# Altium schematic sheet SAML21_Xplained_Pro_Target_MCU.SchDoc: Target MCU
size A3; Organization: ATMEL Norway; Address1: Vestre Rosten 79; Address2: N-7075 TILLER; Address3: NORWAY; DocumentNumber: A09-2241; Revision: 4; SheetNumber: 2; SheetTotal: 10; PageSetup: Record=PageOptions|CenterHorizontal=True|CenterVertical=True|PrintScale=1.01|XCorrection=1.00|YCorrection=1.00|PrintKind=1|BorderSize=5000000|LeftOffset=0|BottomOffset=0|Orientation=2|PaperLength=1000|PaperWidth=1000|Scale=100|PaperSource=7|PrintQuality=-4|MediaType=1|DitherType=10|PaperKind=A3 (297 x 420 mm)|PrintScaleMode=1
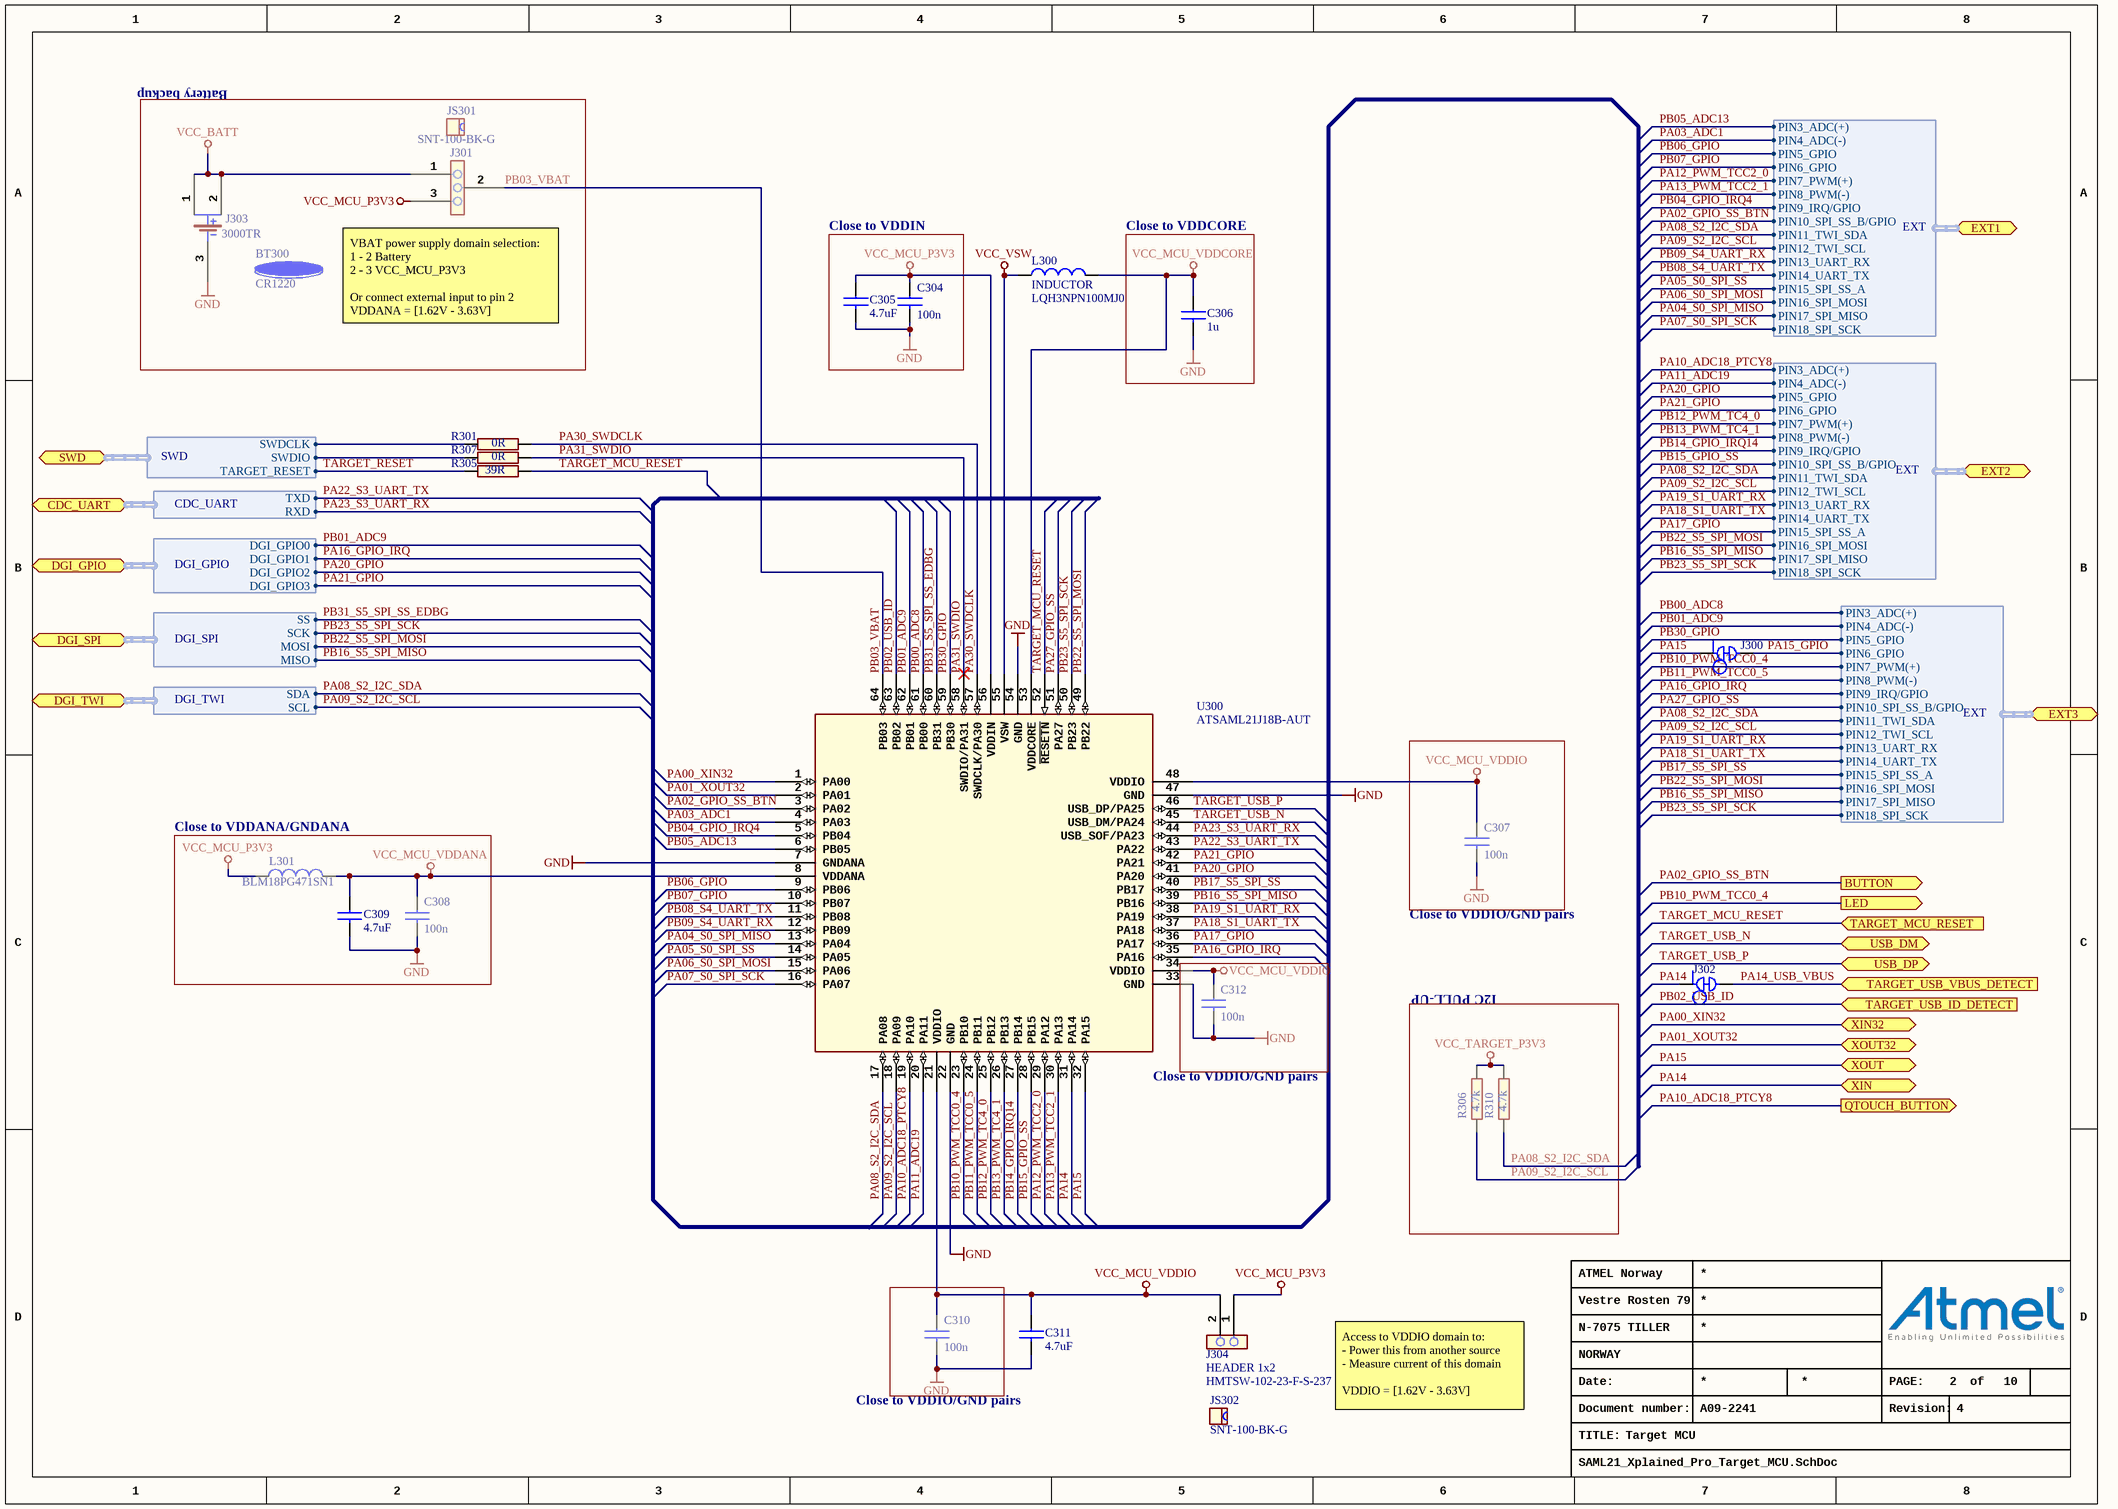
[diagram p0: SAML21_Xplained_Pro_Target_MCU.SchDoc]

## Parts
BT300  value CR1220  [AP9-00125]  (hidden comment: COIN-CELL)
C304  value 100n  [AP1-00053]  (hidden comment: CAP-NONPOL)
C305  value 4.7uF  [AP1-00117]  (hidden comment: CAP-NONPOL)
C306  value 1u  [AP1-00053]  (hidden comment: CAP-NONPOL)
C307  value 100n  [AP1-00053]  (hidden comment: CAP-NONPOL)
C308  value 100n  [AP1-00053]  (hidden comment: CAP-NONPOL)
C309  value 4.7uF  [AP1-00117]  (hidden comment: CAP-NONPOL)
C310  value 100n  [AP1-00053]  (hidden comment: CAP-NONPOL)
C311  value 4.7uF  [AP1-00117]  (hidden comment: CAP-NONPOL)
C312  value 100n  [AP1-00053]  (hidden comment: CAP-NONPOL)
J300  (no value)  [AP9-00044]  (net tie, no BOM)
J301  Same as A08-1614 but with 1mm hole for optimal reflow soldering (no misalignment of the component)  [AP8-00745]  (value not drawn)
J302  (no value)  [AP9-00044]  (net tie, no BOM)
J303  value 3000TR  [AP8-00313]  (hidden comment: Elfa no: 69-525-01)
J304  HEADER 1x2  value HMTSW-102-23-F-S-237  [AP8-00733]
JS301  value SNT-100-BK-G  [AP8-00525]
JS302  value SNT-100-BK-G  [AP8-00525]
L300  INDUCTOR  value LQH3NPN100MJ0  [AP3-00115]
L301  BLM18PG471SN1  [AP3-00005]
R301  value 0R  [AP2-00011]  (hidden comment: R2)
R305  value 39R  [AP2-00011]  (hidden comment: R2)
R306  value 4.7k  [AP2-00011]  (hidden comment: R2)
R307  value 0R  [AP2-00011]  (hidden comment: R2)
R310  value 4.7k  [AP2-00011]  (hidden comment: R2)
U300  value ATSAML21J18B-AUT  [AP6-00173]  (hidden comment: TQFP64)

## Blocks framed on the sheet
Battery backup: BT300 J301 J303 JS301
Close to VDDIN: C304 C305
Close to VDDCORE: C306
Close to VDDANA/GNDANA: C308 C309 L301
I2C PULL-UP: R306 R310

## Ports
BUTTON (out), CDC_UART (harness CDC_UART), DGI_GPIO (harness DGI_GPIO), DGI_SPI (harness DGI_SPI), DGI_TWI (harness DGI_TWI), EXT1 (harness EXT), EXT2 (harness EXT), EXT3 (harness EXT), LED (out), QTOUCH_BUTTON (out), SWD (harness SWD), TARGET_MCU_RESET (in), TARGET_USB_ID_DETECT (in), TARGET_USB_VBUS_DETECT (in), USB_DM (bidir), USB_DP (bidir), XIN32 (bidir), XIN (bidir), XOUT32 (bidir), XOUT (bidir)

## Harnesses
SWD: SWDCLK, SWDIO, TARGET_RESET
DGI_GPIO: DGI_GPIO0, DGI_GPIO1, DGI_GPIO2, DGI_GPIO3
DGI_SPI: MISO, MOSI, SCK, SS
DGI_TWI: SCL, SDA
CDC_UART: RXD, TXD
EXT: PIN10_SPI_SS_B/GPIO, PIN11_TWI_SDA, PIN12_TWI_SCL, PIN13_UART_RX, PIN14_UART_TX, PIN15_SPI_SS_A, PIN16_SPI_MOSI, PIN17_SPI_MISO, PIN18_SPI_SCK, PIN3_ADC(+), PIN4_ADC(-), PIN5_GPIO, PIN6_GPIO, PIN7_PWM(+), PIN8_PWM(-), PIN9_IRQ/GPIO

## Nets
GND: C304.2 C305.2 C306.2 C307.2 C308.2 C309.2 C310.2 C311.2 C312.2 J303.3 U300.7(GNDANA) U300.22(GND) U300.33(GND) U300.47(GND) U300.54(GND)
VCC_BATT: J301.1 J303.1 J303.2
VCC_MCU_P3V3: C304.1 C305.1 J301.3 J304.1 L301.1 U300.56(VDDIN)
VCC_MCU_VDDANA: C308.1 C309.1 L301.2 U300.8(VDDANA)
VCC_MCU_VDDCORE: C306.1 L300.2 U300.53(VDDCORE)
VCC_MCU_VDDIO: C307.1 C310.1 C311.1 C312.1 J304.2 U300.21(VDDIO) U300.34(VDDIO) U300.48(VDDIO)
VCC_TARGET_P3V3: R306.2 R310.2
VCC_VSW: L300.1 U300.55(VSW)
PA00_XIN32: U300.1(PA00) ; port XIN32
PA01_XOUT32: U300.2(PA01) ; port XOUT32
PA02_GPIO_SS_BTN: U300.3(PA02) ; port BUTTON, port EXT1.PIN10_SPI_SS_B/GPIO
PA03_ADC1: U300.4(PA03) ; port EXT1.PIN4_ADC(-)
PA04_S0_SPI_MISO: U300.13(PA04) ; port EXT1.PIN17_SPI_MISO
PA05_S0_SPI_SS: U300.14(PA05) ; port EXT1.PIN15_SPI_SS_A
PA06_S0_SPI_MOSI: U300.15(PA06) ; port EXT1.PIN16_SPI_MOSI
PA07_S0_SPI_SCK: U300.16(PA07) ; port EXT1.PIN18_SPI_SCK
PA08_S2_I2C_SDA: R310.1 U300.17(PA08) ; port DGI_TWI.SDA, port EXT1.PIN11_TWI_SDA, port EXT2.PIN11_TWI_SDA, port EXT3.PIN11_TWI_SDA
PA09_S2_I2C_SCL: R306.1 U300.18(PA09) ; port DGI_TWI.SCL, port EXT1.PIN12_TWI_SCL, port EXT2.PIN12_TWI_SCL, port EXT3.PIN12_TWI_SCL
PA10_ADC18_PTCY8: U300.19(PA10) ; port QTOUCH_BUTTON, port EXT2.PIN3_ADC(+)
PA11_ADC19: U300.20(PA11) ; port EXT2.PIN4_ADC(-)
PA12_PWM_TCC2_0: U300.29(PA12) ; port EXT1.PIN7_PWM(+)
PA13_PWM_TCC2_1: U300.30(PA13) ; port EXT1.PIN8_PWM(-)
PA14: J302.1 U300.31(PA14) ; port XIN
PA14_USB_VBUS: J302.2 ; port TARGET_USB_VBUS_DETECT
PA15: J300.1 U300.32(PA15) ; port XOUT
PA15_GPIO: J300.2 ; port EXT3.PIN6_GPIO
PA16_GPIO_IRQ: U300.35(PA16) ; port DGI_GPIO.DGI_GPIO1, port EXT3.PIN9_IRQ/GPIO
PA17_GPIO: U300.36(PA17) ; port EXT2.PIN15_SPI_SS_A
PA18_S1_UART_TX: U300.37(PA18) ; port EXT2.PIN14_UART_TX, port EXT3.PIN14_UART_TX
PA19_S1_UART_RX: U300.38(PA19) ; port EXT2.PIN13_UART_RX, port EXT3.PIN13_UART_RX
PA20_GPIO: U300.41(PA20) ; port DGI_GPIO.DGI_GPIO2, port EXT2.PIN5_GPIO
PA21_GPIO: U300.42(PA21) ; port DGI_GPIO.DGI_GPIO3, port EXT2.PIN6_GPIO
PA22_S3_UART_TX: U300.43(PA22) ; port CDC_UART.TXD
PA23_S3_UART_RX: U300.44(USB_SOF/PA23) ; port CDC_UART.RXD
PA27_GPIO_SS: U300.51(PA27) ; port EXT3.PIN10_SPI_SS_B/GPIO
PA30_SWDCLK: R301.1 U300.57(SWDCLK/PA30)
PA31_SWDIO: R307.1 U300.58(SWDIO/PA31)
PB00_ADC8: U300.61(PB00) ; port EXT3.PIN3_ADC(+)
PB01_ADC9: U300.62(PB01) ; port DGI_GPIO.DGI_GPIO0, port EXT3.PIN4_ADC(-)
PB02_USB_ID: U300.63(PB02) ; port TARGET_USB_ID_DETECT
PB03_VBAT: J301.2 U300.64(PB03)
PB04_GPIO_IRQ4: U300.5(PB04) ; port EXT1.PIN9_IRQ/GPIO
PB05_ADC13: U300.6(PB05) ; port EXT1.PIN3_ADC(+)
PB06_GPIO: U300.9(PB06) ; port EXT1.PIN5_GPIO
PB07_GPIO: U300.10(PB07) ; port EXT1.PIN6_GPIO
PB08_S4_UART_TX: U300.11(PB08) ; port EXT1.PIN14_UART_TX
PB09_S4_UART_RX: U300.12(PB09) ; port EXT1.PIN13_UART_RX
PB10_PWM_TCC0_4: U300.23(PB10) ; port LED, port EXT3.PIN7_PWM(+)
PB11_PWM_TCC0_5: U300.24(PB11) ; port EXT3.PIN8_PWM(-)
PB12_PWM_TC4_0: U300.25(PB12) ; port EXT2.PIN7_PWM(+)
PB13_PWM_TC4_1: U300.26(PB13) ; port EXT2.PIN8_PWM(-)
PB14_GPIO_IRQ14: U300.27(PB14) ; port EXT2.PIN9_IRQ/GPIO
PB15_GPIO_SS: U300.28(PB15) ; port EXT2.PIN10_SPI_SS_B/GPIO
PB16_S5_SPI_MISO: U300.39(PB16) ; port DGI_SPI.MISO, port EXT2.PIN17_SPI_MISO, port EXT3.PIN17_SPI_MISO
PB17_S5_SPI_SS: U300.40(PB17) ; port EXT3.PIN15_SPI_SS_A
PB22_S5_SPI_MOSI: U300.49(PB22) ; port DGI_SPI.MOSI, port EXT2.PIN16_SPI_MOSI, port EXT3.PIN16_SPI_MOSI
PB23_S5_SPI_SCK: U300.50(PB23) ; port DGI_SPI.SCK, port EXT2.PIN18_SPI_SCK, port EXT3.PIN18_SPI_SCK
PB30_GPIO: U300.59(PB30) ; port EXT3.PIN5_GPIO
PB31_S5_SPI_SS_EDBG: U300.60(PB31) ; port DGI_SPI.SS
TARGET_MCU_RESET: R305.2 U300.52(~{RESETN}) ; port TARGET_MCU_RESET
TARGET_RESET: R305.1 ; port SWD.TARGET_RESET
TARGET_USB_N: U300.45(USB_DM/PA24) ; port USB_DM
TARGET_USB_P: U300.46(USB_DP/PA25) ; port USB_DP
NetR301_2: R301.2 ; port SWD.SWDCLK
NetR307_2: R307.2 ; port SWD.SWDIO

## Notes on the sheet
- (near J301) VBAT power supply domain selection:
  1 - 2 Battery
  2 - 3 VCC_MCU_P3V3
  Or connect external input to pin 2
  VDDANA = [1.62V - 3.63V]
- Close to VDDIO/GND pairs
- (near U300) Close to VDDIO/GND pairs
- Access to VDDIO domain to:
  - Power this from another source
  - Measure current of this domain
  VDDIO = [1.62V - 3.63V]
- Date:
- PAGE:
- of
- TITLE:
- Document number:
- Revision:

## Library data of the parts
BT300 = A09-0619: CR1220 Lithium coin-cell battery; PartGroup: Other Devices,Power Products,Batteries; Manufacturer: Panasonic; AN: A09-0619; MPN: CR1220; Height: 2
C304 C307 C308 C310 C312 = A01-0246: Ceramic capacitor, SMD 0402, X7R, 16V, +/-10%; PartGroup: Capacitors,Ceramic,SMD 0402; Manufacturer: Kemet; MPN: C0402C104K4RACTU; TemperatureRange: -55 - +125 deg C; AN: A01-0246; Tolerance: 16V, +/-10%; Height: 0,5
C305 C309 C311 = A01-0377: Ceramic capacitor, SMD 0603, X5R, 10V, 10% (de31036); PartGroup: Capacitors,Ceramic,SMD 0603; Manufacturer: tdk; MPN: C1608X5R1A475K; TemperatureRange: -55 - +85 deg C; AN: A01-0377; Tolerance: 10%; Height: 0.800000011920929
C306 = A01-0286: Ceramic capacitor, SMD 0402, X5R, 6.3V, +/-10% (de26942); PartGroup: Capacitors,Ceramic,SMD 0402; Manufacturer: Kemet; MPN: C0402C105K9PAC; TemperatureRange: -55 to 85 deg C; AN: A01-0286; Tolerance: +/-10%; Height: 0,5
J300 J302 = A09-0783: Default closed SMD strap, 0603 size; PartGroup: Mechanical devices,PCB implemented components; Value: SMD-STRAP_0603_CLOSED; AN: A09-0783; Height: 0
J301 = A08-1799: 1x3 pin header, 2.54mm pitch, Pin-in-Paste THM, 1mm hole; PartGroup: Mechanical devices,Connectors,Pin headers; Manufacturer: SAMTEC; Value: HMTSW-103-23-F-S-237; AN: A08-1799; Height: 6,09999990463257; MPN: HMTSW-103-23-F-S-237
J303 = A08-0554: CR1220 Li-Ion coin-cell battery clip, SMD; PartGroup: Mechanical devices,Connectors,Power; Manufacturer: Keystone Corp.; AN: A08-0554; Height: 3,1800000667572; MPN: 3000TR
J304 = A08-1754: 1x2 pin header, 2.54mm pitch, Pin-in-Paste THM; PartGroup: Mechanical devices,Connectors,Pin headers; Manufacturer: SAMTEC; TemperatureRange: - 55 deg C to + 125 deg C; AN: A08-1754; Height: 6.09999990463257; MPN: HMTSW-102-23-F-S-237
JS301 JS302 = A08-0543: Jumper cap for 2.54mm pinheader; PartGroup: Mechanical devices,Mounting accessories,Other; Manufacturer: SAMTEC; AN: A08-0543; MPN: SNT-100-BK-G
L300 = A03-0191: 10uH power inductor, Isat = 560mA , Itemp = 710mA, Rdc = 0.360ohm; PartGroup: Inductors,Power Inductors; Manufacturer: Murata; Tolerance: Â±20%; TemperatureRange: -40 - 85Â°C; AN: A03-0191; MPN: LQH3NPN100MJ0; Height: 1.10000002384186
L301 = A03-0035: SMD RF inductor 0603. Z=470Ohm (@100MHz), Max R(dc)=0.65Ohm, Max current=1A; PartGroup: Inductors,EMI; Manufacturer: Murata; Tolerance: ±25%; TemperatureRange: -55°C to +125°C; AN: A03-0035; Value: BLM18PG471SN1; Height: 0,800000011920929; MPN: BLM18PG471SN1
R301 R307 = A02-0163: RES 0.0 OHM 1/16W 0402 SMD; PartGroup: Resistors,SMD,0402 1%; Manufacturer: (n/a); MPN: RMCF0402ZT0R00; Tolerance: 1 %; TemperatureRange: -55 - +125 deg C; AN: A02-0163; Height: 0.349999994039536
R305 = A02-0178: Thick film resistor, SMD 0402, 1/16W, 1%; PartGroup: Resistors,SMD,0402 1%; TemperatureRange: -55 - +125 deg C; AN: A02-0178; Tolerance: 1 %; Height: 0,349999994039536
R306 R310 = A02-0228: Thick film resistor, SMD 0402, 1/16W, 1%; PartGroup: Resistors,SMD,0402 1%; TemperatureRange: -55 - +125 deg C; AN: A02-0228; Tolerance: 1 %; Height: 0.349999994039536
U300 = A06-1311: Atmel 32-bit RISC MCU 64pin; PartGroup: Integrated Circuits,MCU, MPU, DSP,ARM MCU; TemperatureRange: -40Â°C to +85Â°C; ComponentStatus: 'New (not verified)'; Design comment: *; AN: A06-1311; Height: 1,20000004768372; FootprintStatus: 'Active (Verified)'